# EAGLE schematic LTC6811_slave_24s_rev0 (EAGLE 9.3.1)

## Sheet 1 of 2
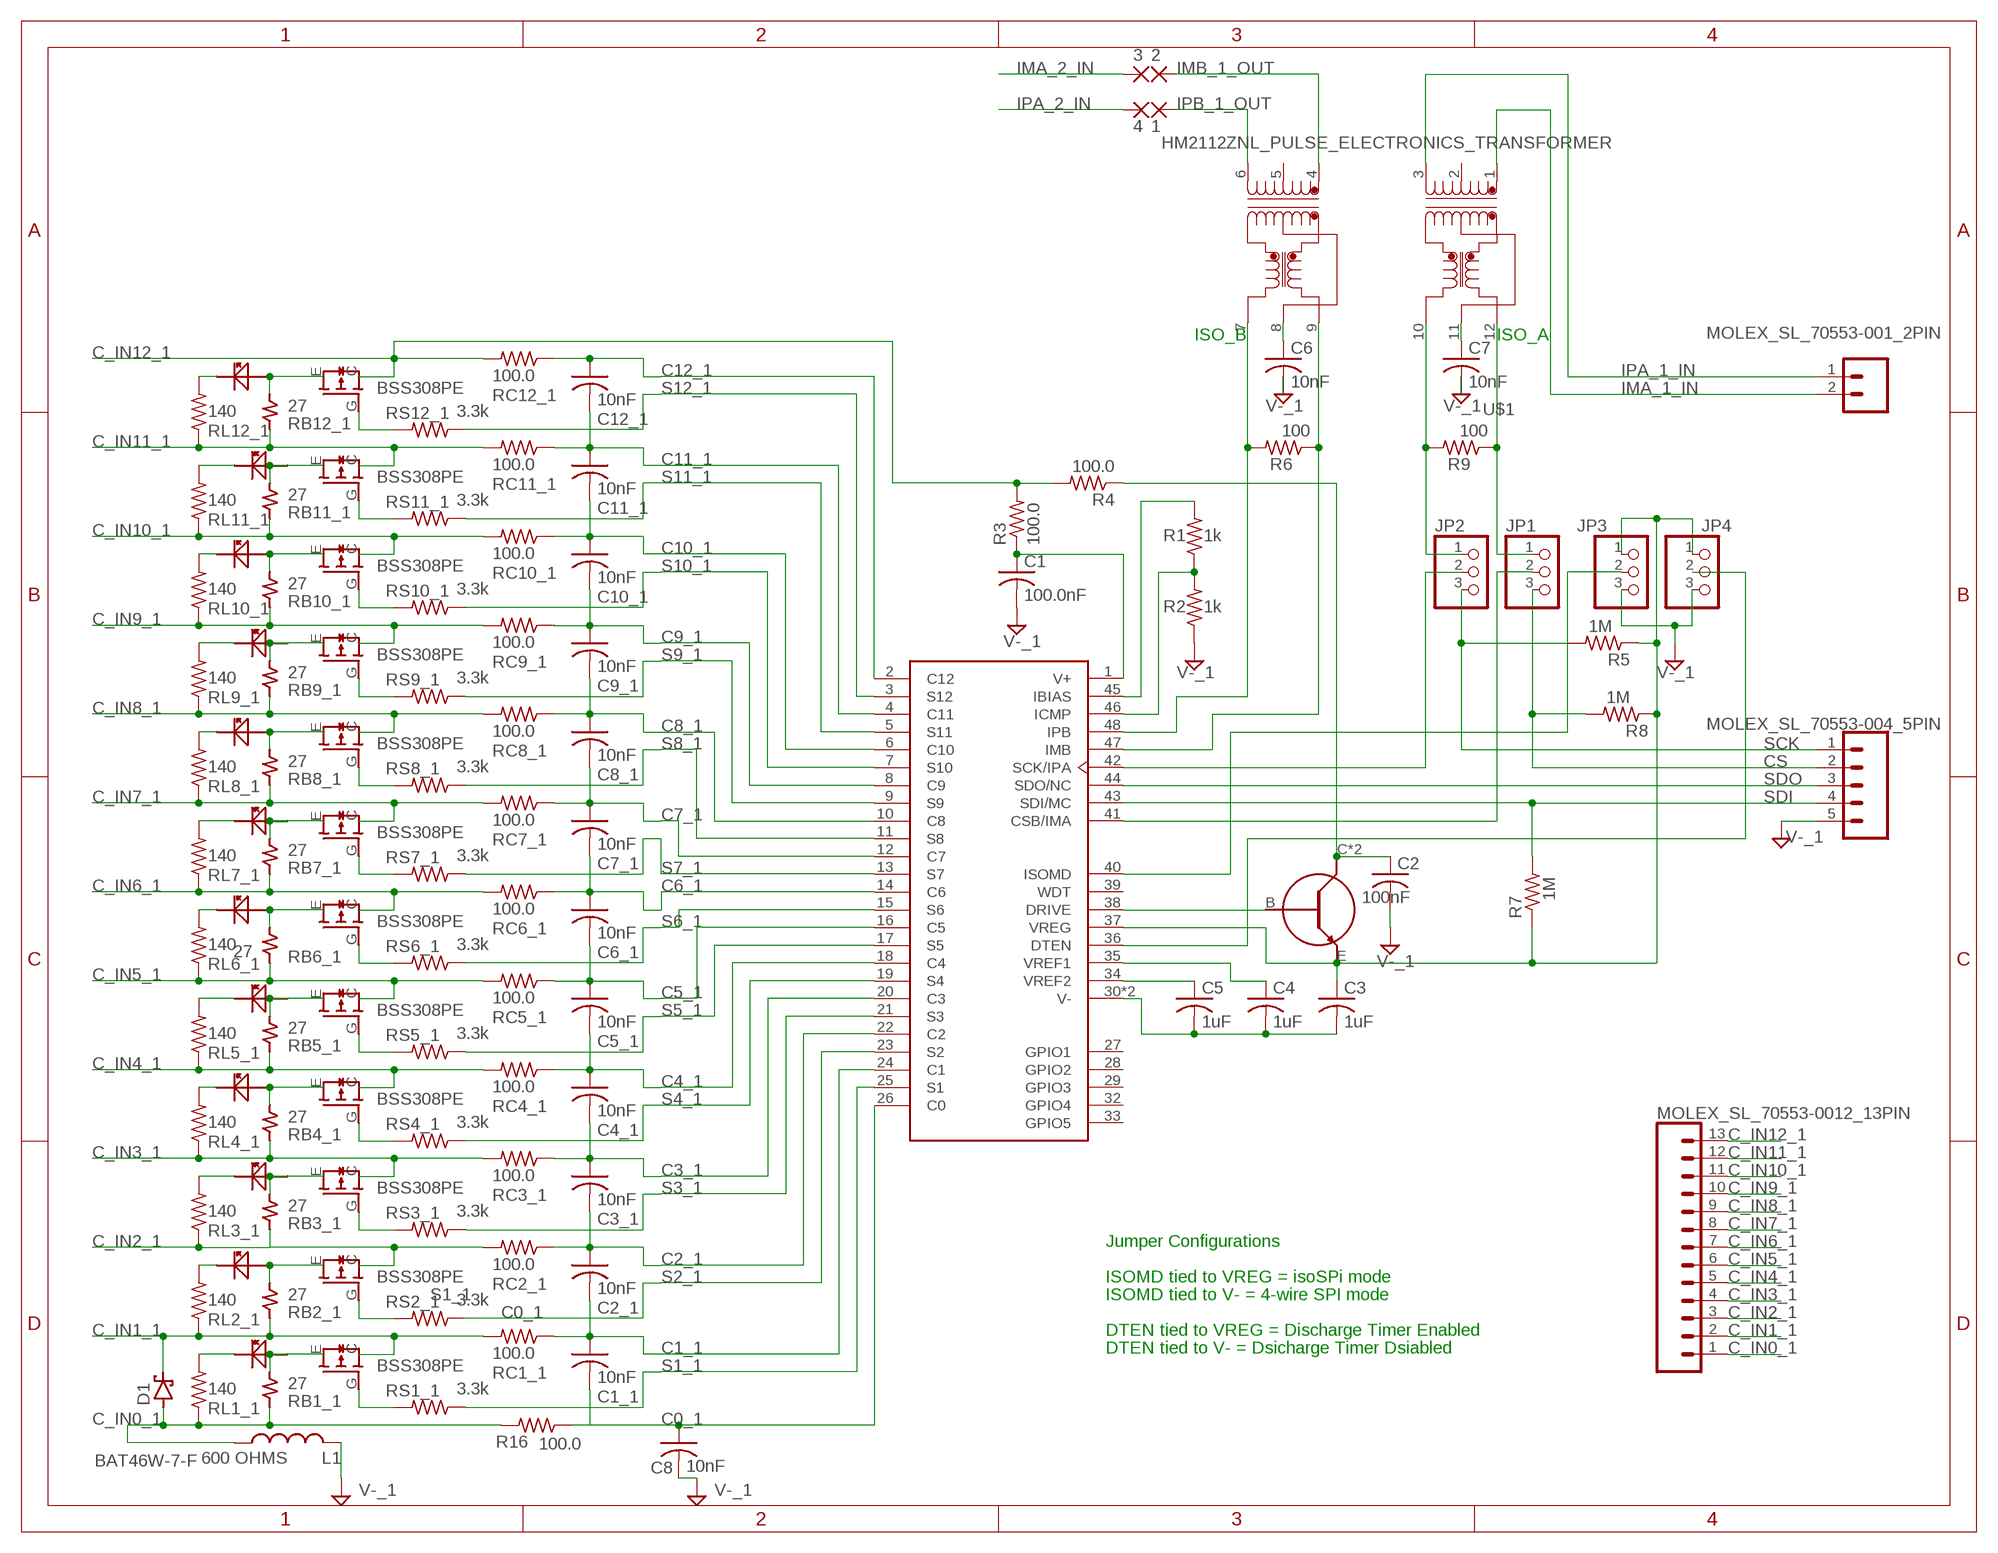
[diagram p0: schematic, sheet 1]

### Parts
1  WIREPAD2,15/1,0  [2,15/1,0]
2  WIREPAD2,15/1,0  [2,15/1,0]
3  WIREPAD2,15/1,0  [2,15/1,0]
4  WIREPAD2,15/1,0  [2,15/1,0]
C1  100.0nF  C-USC0805  [C0805]
C1_1  10nF  C-USC0805  [C0805]
C2  100nF  C-USC0805  [C0805]
C2_1  10nF  C-USC0805  [C0805]
C3  1uF  C-USC0805  [C0805]
C3_1  10nF  C-USC0805  [C0805]
C4  1uF  C-USC0805  [C0805]
C4_1  10nF  C-USC0805  [C0805]
C5  1uF  C-USC0805  [C0805]
C5_1  10nF  C-USC0805  [C0805]
C6  10nF  C-USC0805  [C0805]
C6_1  10nF  C-USC0805  [C0805]
C7  10nF  C-USC0805  [C0805]
C7_1  10nF  C-USC0805  [C0805]
C8  10nF  C-USC0805  [C0805]
C8_1  10nF  C-USC0805  [C0805]
C9_1  10nF  C-USC0805  [C0805]
C10_1  10nF  C-USC0805  [C0805]
C11_1  10nF  C-USC0805  [C0805]
C12_1  10nF  C-USC0805  [C0805]
D1  BAT46W-7-F  [SOD123]
DZT5551-13  DZT5551-13  [SOT223-4]
JP1  PINHD-1X3  [1X03]
JP2  PINHD-1X3  [1X03]
JP3  PINHD-1X3  [1X03]
JP4  PINHD-1X3  [1X03]
L1  600 OHMS  0805_FERRITEBEAD_INDUCTOR  [0805_COMPONENT]
LED1_3  LED_0805  [0805_COMPONENT]
LED1_4  LED_0805  [0805_COMPONENT]
LED1_5  LED_0805  [0805_COMPONENT]
LED1_6  LED_0805  [0805_COMPONENT]
LED1_7  LED_0805  [0805_COMPONENT]
LED1_8  LED_0805  [0805_COMPONENT]
LED1_9  LED_0805  [0805_COMPONENT]
LED1_10  LED_0805  [0805_COMPONENT]
LED1_11  LED_0805  [0805_COMPONENT]
LED1_12  LED_0805  [0805_COMPONENT]
LED1_13  LED_0805  [0805_COMPONENT]
LED1_14  LED_0805  [0805_COMPONENT]
MOLEX_SL_70553-001_2PIN  CONN_02  [1X02]
MOLEX_SL_70553-004_5PIN  CONN_05  [1X05]
MOLEX_SL_70553-0012_13PIN  CONN_13  [1X13]
R1  1k  R-US_R0805  [R0805]
R2  1k  R-US_R0805  [R0805]
R3  100.0  R-US_R0805  [R0805]
R4  100.0  R-US_R0805  [R0805]
R5  1M  R-US_R0805  [R0805]
R6  100  R-US_R0805  [R0805]
R7  1M  R-US_R0805  [R0805]
R8  1M  R-US_R0805  [R0805]
R9  100  R-US_R0805  [R0805]
R16  100.0  R-US_R0805  [R0805]
RB1_1  27  2817_RESISTOR  [2817_COMPONENT]
RB2_1  27  2817_RESISTOR  [2817_COMPONENT]
RB3_1  27  2817_RESISTOR  [2817_COMPONENT]
RB4_1  27  2817_RESISTOR  [2817_COMPONENT]
RB5_1  27  2817_RESISTOR  [2817_COMPONENT]
RB6_1  27  2817_RESISTOR  [2817_COMPONENT]
RB7_1  27  2817_RESISTOR  [2817_COMPONENT]
RB8_1  27  2817_RESISTOR  [2817_COMPONENT]
RB9_1  27  2817_RESISTOR  [2817_COMPONENT]
RB10_1  27  2817_RESISTOR  [2817_COMPONENT]
RB11_1  27  2817_RESISTOR  [2817_COMPONENT]
RB12_1  27  2817_RESISTOR  [2817_COMPONENT]
RC1_1  100.0  R-US_R0805  [R0805]
RC2_1  100.0  R-US_R0805  [R0805]
RC3_1  100.0  R-US_R0805  [R0805]
RC4_1  100.0  R-US_R0805  [R0805]
RC5_1  100.0  R-US_R0805  [R0805]
RC6_1  100.0  R-US_R0805  [R0805]
RC7_1  100.0  R-US_R0805  [R0805]
RC8_1  100.0  R-US_R0805  [R0805]
RC9_1  100.0  R-US_R0805  [R0805]
RC10_1  100.0  R-US_R0805  [R0805]
RC11_1  100.0  R-US_R0805  [R0805]
RC12_1  100.0  R-US_R0805  [R0805]
RL1_1  140  R-US_R0805  [R0805]
RL2_1  140  R-US_R0805  [R0805]
RL3_1  140  R-US_R0805  [R0805]
RL4_1  140  R-US_R0805  [R0805]
RL5_1  140  R-US_R0805  [R0805]
RL6_1  140  R-US_R0805  [R0805]
RL7_1  140  R-US_R0805  [R0805]
RL8_1  140  R-US_R0805  [R0805]
RL9_1  140  R-US_R0805  [R0805]
RL10_1  140  R-US_R0805  [R0805]
RL11_1  140  R-US_R0805  [R0805]
RL12_1  140  R-US_R0805  [R0805]
RS1_1  3.3k  R-US_R0805  [R0805]
RS2_1  3.3k  R-US_R0805  [R0805]
RS3_1  3.3k  R-US_R0805  [R0805]
RS4_1  3.3k  R-US_R0805  [R0805]
RS5_1  3.3k  R-US_R0805  [R0805]
RS6_1  3.3k  R-US_R0805  [R0805]
RS7_1  3.3k  R-US_R0805  [R0805]
RS8_1  3.3k  R-US_R0805  [R0805]
RS9_1  3.3k  R-US_R0805  [R0805]
RS10_1  3.3k  R-US_R0805  [R0805]
RS11_1  3.3k  R-US_R0805  [R0805]
RS12_1  3.3k  R-US_R0805  [R0805]
T1_3  BSS308PEH6327  [SOT23]
T1_4  BSS308PEH6327  [SOT23]
T1_5  BSS308PEH6327  [SOT23]
T1_6  BSS308PEH6327  [SOT23]
T1_7  BSS308PEH6327  [SOT23]
T1_8  BSS308PEH6327  [SOT23]
T1_9  BSS308PEH6327  [SOT23]
T1_10  BSS308PEH6327  [SOT23]
T1_11  BSS308PEH6327  [SOT23]
T1_12  BSS308PEH6327  [SOT23]
T1_13  BSS308PEH6327  [SOT23]
T1_14  BSS308PEH6327  [SOT23]
U1  LTC6811HG-2#PBF  [LTC6811-1]
U$1  HM2112ZNL_PULSE_ELECTRONICS_TRANSFORMER  [HM2112ZNL_12SMT]

### Nets
C0_1: C8.1 R16.1 U1.26(C0)
C1_1: C1_1.1 C2_1.2 RC1_1.1 U1.24(C1)
C2_1: C2_1.1 C3_1.2 RC2_1.1 U1.22(C2)
C3_1: C3_1.1 C4_1.2 RC3_1.1 U1.20(C3)
C4_1: C4_1.1 C5_1.2 RC4_1.1 U1.18(C4)
C5_1: C5_1.1 C6_1.2 RC5_1.1 U1.16(C5)
C6_1: C6_1.1 C7_1.2 RC6_1.1 U1.14(C6)
C7_1: C7_1.1 C8_1.2 RC7_1.1 U1.12(C7)
C8_1: C8_1.1 C9_1.2 RC8_1.1 U1.10(C8)
C9_1: C9_1.1 C10_1.2 RC9_1.1 U1.8(C9)
C10_1: C10_1.1 C11_1.2 RC10_1.1 U1.6(C10)
C11_1: C11_1.1 C12_1.2 RC11_1.1 U1.4(C11)
C12_1: C12_1.1 RC12_1.1 U1.2(C12)
C_IN0_1: D1.A L1.1 MOLEX_SL_70553-0012_13PIN.1 R16.2 RB1_1.2 RL1_1.1
C_IN1_1: D1.C MOLEX_SL_70553-0012_13PIN.2 RB2_1.2 RC1_1.2 RL2_1.1 T1_3.C
C_IN2_1: MOLEX_SL_70553-0012_13PIN.3 RB3_1.2 RC2_1.2 RL3_1.1 T1_4.C
C_IN3_1: MOLEX_SL_70553-0012_13PIN.4 RB4_1.2 RC3_1.2 RL4_1.1 T1_7.C
C_IN4_1: MOLEX_SL_70553-0012_13PIN.5 RB5_1.2 RC4_1.2 RL5_1.1 T1_8.C
C_IN5_1: MOLEX_SL_70553-0012_13PIN.6 RB6_1.2 RC5_1.2 RL6_1.1 T1_5.C
C_IN6_1: MOLEX_SL_70553-0012_13PIN.7 RB7_1.2 RC6_1.2 RL7_1.1 T1_6.C
C_IN7_1: MOLEX_SL_70553-0012_13PIN.8 RB8_1.2 RC7_1.2 RL8_1.1 T1_9.C
C_IN8_1: MOLEX_SL_70553-0012_13PIN.9 RB9_1.2 RC8_1.2 RL9_1.1 T1_10.C
C_IN9_1: MOLEX_SL_70553-0012_13PIN.10 RB10_1.2 RC9_1.2 RL10_1.1 T1_11.C
C_IN10_1: MOLEX_SL_70553-0012_13PIN.11 RB11_1.2 RC10_1.2 RL11_1.1 T1_12.C
C_IN11_1: MOLEX_SL_70553-0012_13PIN.12 RB12_1.2 RC11_1.2 RL12_1.1 T1_13.C
C_IN12_1: MOLEX_SL_70553-0012_13PIN.13 R3.2 R4.2 RC12_1.2 T1_14.C
CS: JP1.3 MOLEX_SL_70553-004_5PIN.2 R8.2
CS_OR_IMA: JP1.2 U1.41(CSB/IMA)
DRIVE: DZT5551-13.B U1.38(DRIVE)
DTEN: JP4.2 U1.36(DTEN)
IBIAS: R1.2 U1.45(IBIAS)
ICMP: R1.1 R2.2 U1.46(ICMP)
IMA_1_IN: MOLEX_SL_70553-001_2PIN.2 U$1.1
IMA_2_IN: 3.1(P) ; also sheet 2
IMB: R6.1 U1.47(IMB) U$1.9
IMB_1_OUT: 2.1(P) U$1.4
IPA_1_IN: MOLEX_SL_70553-001_2PIN.1 U$1.3
IPA_2_IN: 4.1(P) ; also sheet 2
IPB: R6.2 U1.48(IPB) U$1.7
IPB_1_OUT: 1.1(P) U$1.6
ISOMD: JP3.2 U1.40(ISOMD)
N$3: C6.1 U$1.8
N$5: C1.1 R3.1 U1.1(V+)
N$7: JP2.1 R9.2 U$1.10
N$8: JP1.1 R9.1 U$1.12
N$9: C7.1 U$1.11
N$32: LED1_11.2 RB9_1.1 T1_11.E
N$33: RS9_1.2 T1_11.G(B)
N$34: LED1_11.1 RL9_1.2
N$35: LED1_12.2 RB10_1.1 T1_12.E
N$36: RS10_1.2 T1_12.G(B)
N$37: LED1_12.1 RL10_1.2
N$39: LED1_13.2 RB11_1.1 T1_13.E
N$40: LED1_3.2 RB1_1.1 T1_3.E
N$41: RS1_1.2 T1_3.G(B)
N$42: LED1_3.1 RL1_1.2
N$43: LED1_4.2 RB2_1.1 T1_4.E
N$44: RS2_1.2 T1_4.G(B)
N$45: LED1_4.1 RL2_1.2
N$46: C1_1.2
N$48: LED1_5.2 RB5_1.1 T1_5.E
N$49: RS5_1.2 T1_5.G(B)
N$50: LED1_5.1 RL5_1.2
N$51: LED1_6.2 RB6_1.1 T1_6.E
N$52: RS6_1.2 T1_6.G(B)
N$53: LED1_6.1 RL6_1.2
N$55: LED1_9.2 RB7_1.1 T1_9.E
N$56: LED1_7.2 RB3_1.1 T1_7.E
N$57: RS3_1.2 T1_7.G(B)
N$58: LED1_7.1 RL3_1.2
N$59: LED1_8.2 RB4_1.1 T1_8.E
N$60: RS4_1.2 T1_8.G(B)
N$61: LED1_8.1 RL4_1.2
N$62: RS11_1.2 T1_13.G(B)
N$63: RS7_1.2 T1_9.G(B)
N$64: LED1_9.1 RL7_1.2
N$65: LED1_10.2 RB8_1.1 T1_10.E
N$66: RS8_1.2 T1_10.G(B)
N$67: LED1_10.1 RL8_1.2
N$69: LED1_13.1 RL11_1.2
N$70: LED1_14.2 RB12_1.1 T1_14.E
N$71: RS12_1.2 T1_14.G(B)
N$72: LED1_14.1 RL12_1.2
S1_1: RS1_1.1 U1.25(S1)
S2_1: RS2_1.1 U1.23(S2)
S3_1: RS3_1.1 U1.21(S3)
S4_1: RS4_1.1 U1.19(S4)
S5_1: RS5_1.1 U1.17(S5)
S6_1: RS6_1.1 U1.15(S6)
S7_1: RS7_1.1 U1.13(S7)
S8_1: RS8_1.1 U1.11(S8)
S9_1: RS9_1.1 U1.9(S9)
S10_1: RS10_1.1 U1.7(S10)
S11_1: RS11_1.1 U1.5(S11)
S12_1: RS12_1.1 U1.3(S12)
SCK: JP2.3 MOLEX_SL_70553-004_5PIN.1 R5.2
SCK_OR_IPA: JP2.2 U1.42(SCK/IPA)
SDI: MOLEX_SL_70553-004_5PIN.4 R7.2 U1.43(SDI/MC)
SDO: MOLEX_SL_70553-004_5PIN.3 U1.44(SDO/NC)
V-_1: C1.2 C2.2 C3.2 C4.2 C5.2 C6.2 C7.2 C8.2 JP3.3 JP4.3 L1.2 MOLEX_SL_70553-004_5PIN.5 R2.1 U1.30(V-) U1.31(V-) ; supply symbol labelled GND
VREF1_C4: C4.1 U1.35(VREF1)
VREF2_C5: C5.1 U1.34(VREF2)
VREG: C3.1 DZT5551-13.E JP3.1 JP4.1 R5.1 R7.1 R8.1 U1.37(VREG)
VREG_CAP: C2.1 DZT5551-13.C DZT5551-13.C@2(C) R4.1
Unconnected: U1.27(GPIO1) U1.28(GPIO2) U1.29(GPIO3) U1.32(GPIO4) U1.33(GPIO5) U1.39(WDT) U$1.2 U$1.5

### Notes on the sheet
- ISO_B | ISO_A
- Jumper Configurations
- ISOMD tied to VREG = isoSPi mode
- ISOMD tied to V- = 4-wire SPI mode
- DTEN tied to VREG = Discharge Timer Enabled
- DTEN tied to V- = Dsicharge Timer Dsiabled

## Sheet 2 of 2
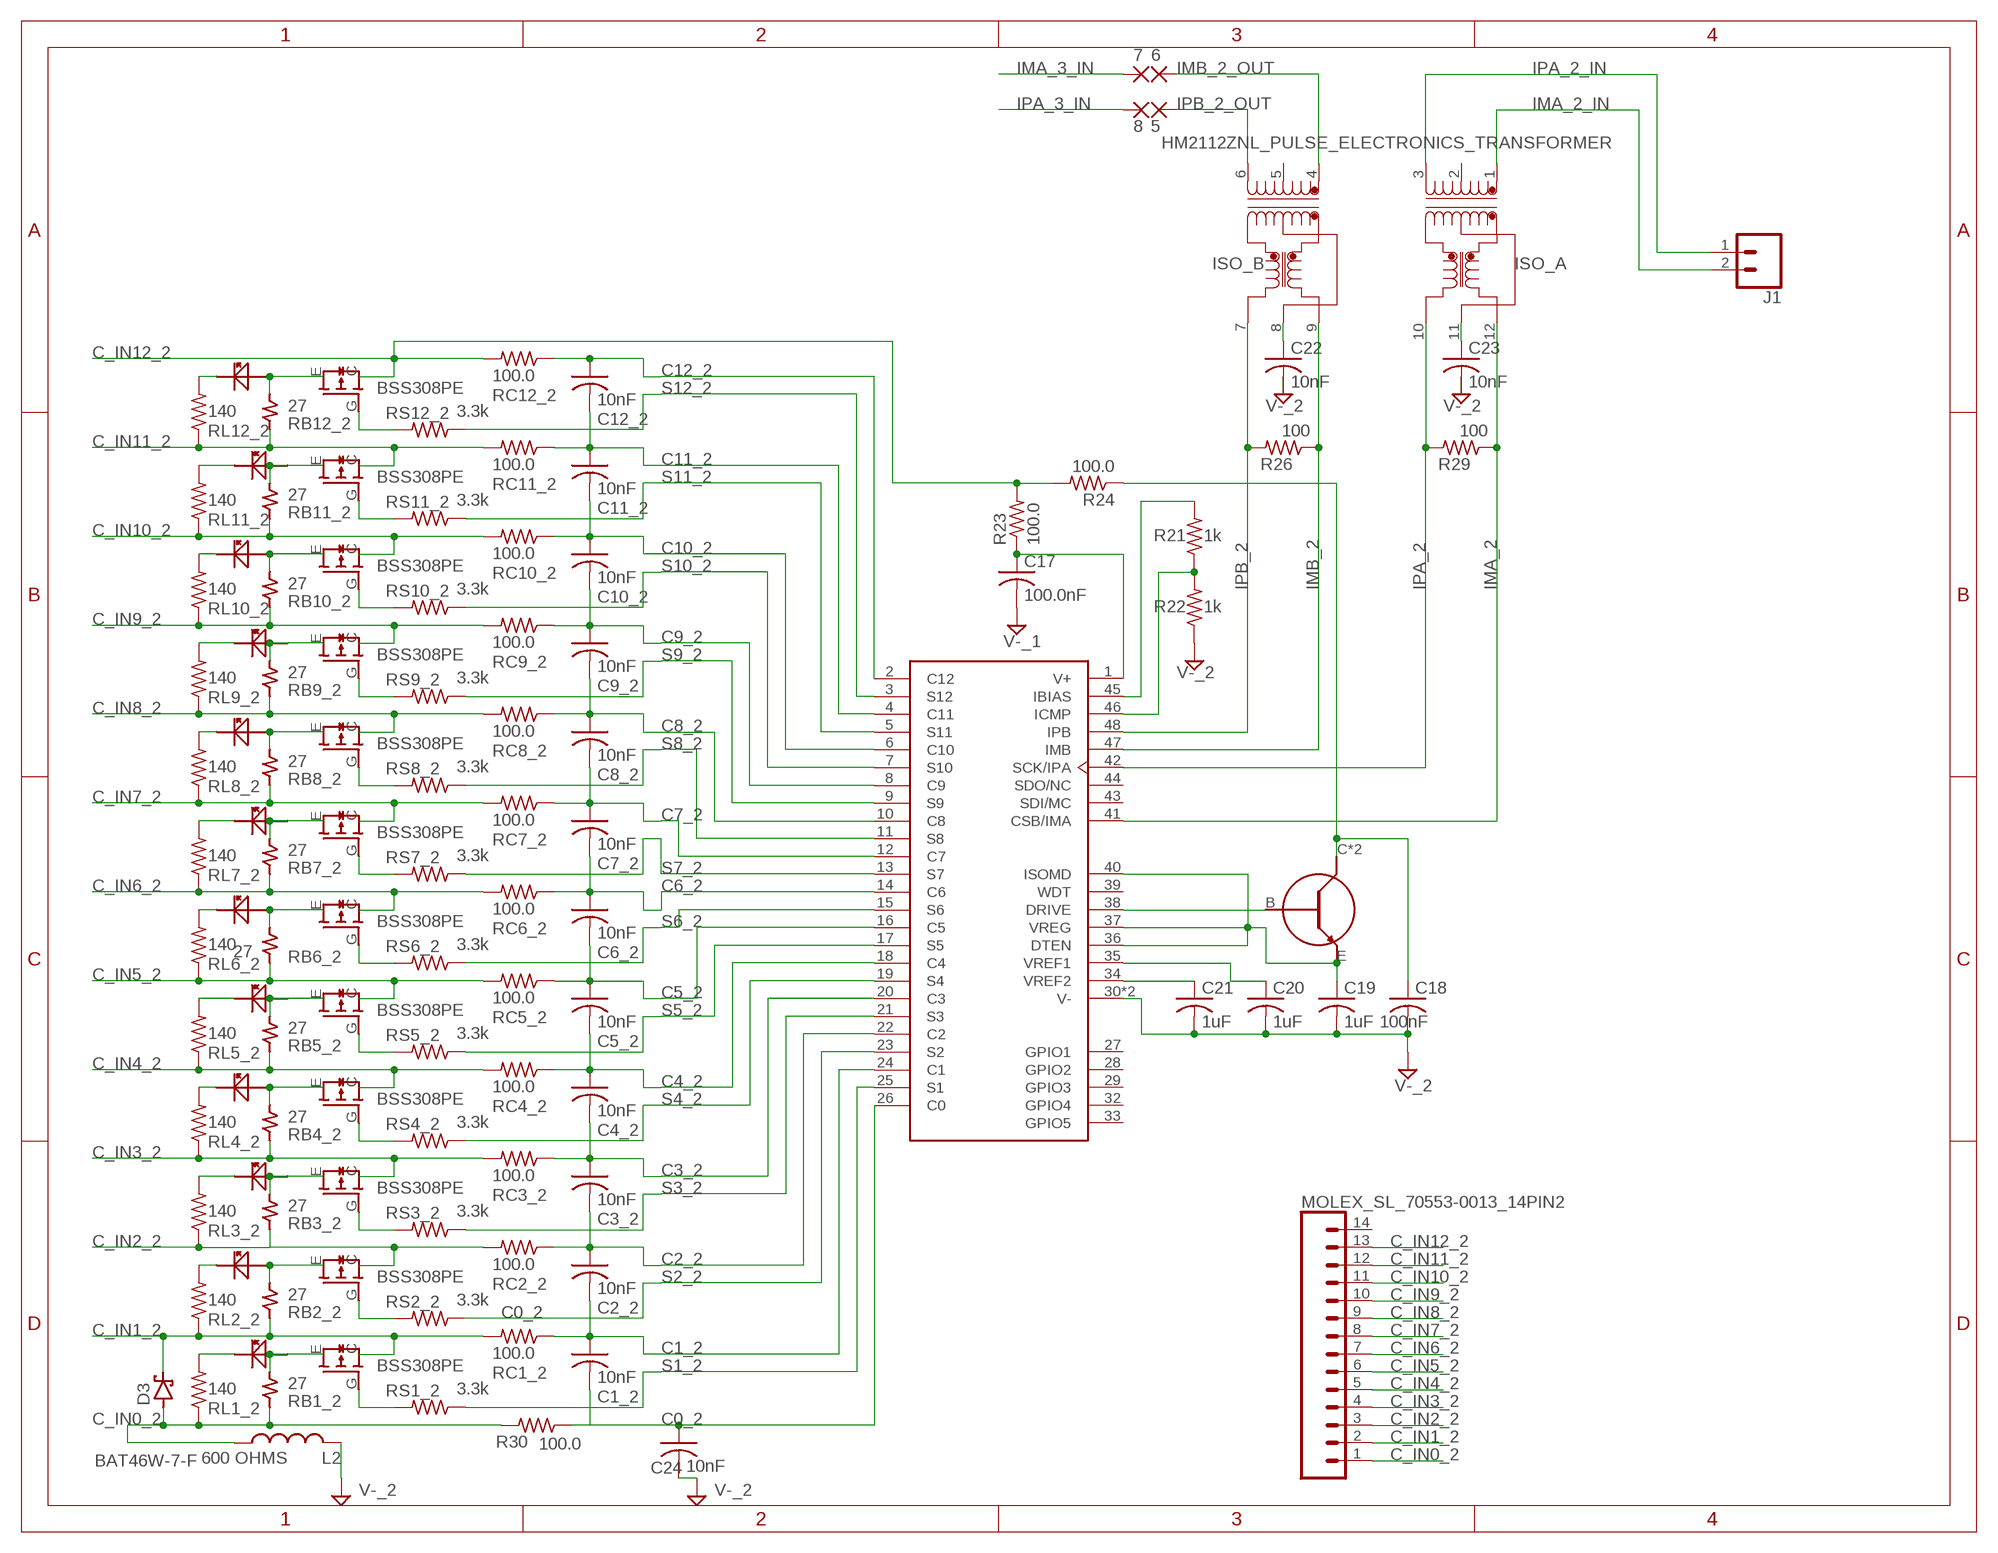
[diagram p1: schematic, sheet 2]

### Parts
5  WIREPAD2,15/1,0  [2,15/1,0]
6  WIREPAD2,15/1,0  [2,15/1,0]
7  WIREPAD2,15/1,0  [2,15/1,0]
8  WIREPAD2,15/1,0  [2,15/1,0]
C1_2  10nF  C-USC0805  [C0805]
C2_2  10nF  C-USC0805  [C0805]
C3_2  10nF  C-USC0805  [C0805]
C4_2  10nF  C-USC0805  [C0805]
C5_2  10nF  C-USC0805  [C0805]
C6_2  10nF  C-USC0805  [C0805]
C7_2  10nF  C-USC0805  [C0805]
C8_2  10nF  C-USC0805  [C0805]
C9_2  10nF  C-USC0805  [C0805]
C10_2  10nF  C-USC0805  [C0805]
C11_2  10nF  C-USC0805  [C0805]
C12_2  10nF  C-USC0805  [C0805]
C17  100.0nF  C-USC0805  [C0805]
C18  100nF  C-USC0805  [C0805]
C19  1uF  C-USC0805  [C0805]
C20  1uF  C-USC0805  [C0805]
C21  1uF  C-USC0805  [C0805]
C22  10nF  C-USC0805  [C0805]
C23  10nF  C-USC0805  [C0805]
C24  10nF  C-USC0805  [C0805]
D3  BAT46W-7-F  [SOD123]
DZT5551-2  DZT5551-13  [SOT223-4]
J1  CONN_02  [1X02]
L2  600 OHMS  0805_FERRITEBEAD_INDUCTOR  [0805_COMPONENT]
LED1_25  LED_0805  [0805_COMPONENT]
LED1_26  LED_0805  [0805_COMPONENT]
LED1_27  LED_0805  [0805_COMPONENT]
LED1_28  LED_0805  [0805_COMPONENT]
LED1_29  LED_0805  [0805_COMPONENT]
LED1_30  LED_0805  [0805_COMPONENT]
LED1_31  LED_0805  [0805_COMPONENT]
LED1_32  LED_0805  [0805_COMPONENT]
LED1_33  LED_0805  [0805_COMPONENT]
LED1_34  LED_0805  [0805_COMPONENT]
LED1_35  LED_0805  [0805_COMPONENT]
LED1_36  LED_0805  [0805_COMPONENT]
MOLEX_SL_70553-0013_14PIN2  CONN_14  [1X14]
R21  1k  R-US_R0805  [R0805]
R22  1k  R-US_R0805  [R0805]
R23  100.0  R-US_R0805  [R0805]
R24  100.0  R-US_R0805  [R0805]
R26  100  R-US_R0805  [R0805]
R29  100  R-US_R0805  [R0805]
R30  100.0  R-US_R0805  [R0805]
RB1_2  27  2817_RESISTOR  [2817_COMPONENT]
RB2_2  27  2817_RESISTOR  [2817_COMPONENT]
RB3_2  27  2817_RESISTOR  [2817_COMPONENT]
RB4_2  27  2817_RESISTOR  [2817_COMPONENT]
RB5_2  27  2817_RESISTOR  [2817_COMPONENT]
RB6_2  27  2817_RESISTOR  [2817_COMPONENT]
RB7_2  27  2817_RESISTOR  [2817_COMPONENT]
RB8_2  27  2817_RESISTOR  [2817_COMPONENT]
RB9_2  27  2817_RESISTOR  [2817_COMPONENT]
RB10_2  27  2817_RESISTOR  [2817_COMPONENT]
RB11_2  27  2817_RESISTOR  [2817_COMPONENT]
RB12_2  27  2817_RESISTOR  [2817_COMPONENT]
RC1_2  100.0  R-US_R0805  [R0805]
RC2_2  100.0  R-US_R0805  [R0805]
RC3_2  100.0  R-US_R0805  [R0805]
RC4_2  100.0  R-US_R0805  [R0805]
RC5_2  100.0  R-US_R0805  [R0805]
RC6_2  100.0  R-US_R0805  [R0805]
RC7_2  100.0  R-US_R0805  [R0805]
RC8_2  100.0  R-US_R0805  [R0805]
RC9_2  100.0  R-US_R0805  [R0805]
RC10_2  100.0  R-US_R0805  [R0805]
RC11_2  100.0  R-US_R0805  [R0805]
RC12_2  100.0  R-US_R0805  [R0805]
RL1_2  140  R-US_R0805  [R0805]
RL2_2  140  R-US_R0805  [R0805]
RL3_2  140  R-US_R0805  [R0805]
RL4_2  140  R-US_R0805  [R0805]
RL5_2  140  R-US_R0805  [R0805]
RL6_2  140  R-US_R0805  [R0805]
RL7_2  140  R-US_R0805  [R0805]
RL8_2  140  R-US_R0805  [R0805]
RL9_2  140  R-US_R0805  [R0805]
RL10_2  140  R-US_R0805  [R0805]
RL11_2  140  R-US_R0805  [R0805]
RL12_2  140  R-US_R0805  [R0805]
RS1_2  3.3k  R-US_R0805  [R0805]
RS2_2  3.3k  R-US_R0805  [R0805]
RS3_2  3.3k  R-US_R0805  [R0805]
RS4_2  3.3k  R-US_R0805  [R0805]
RS5_2  3.3k  R-US_R0805  [R0805]
RS6_2  3.3k  R-US_R0805  [R0805]
RS7_2  3.3k  R-US_R0805  [R0805]
RS8_2  3.3k  R-US_R0805  [R0805]
RS9_2  3.3k  R-US_R0805  [R0805]
RS10_2  3.3k  R-US_R0805  [R0805]
RS11_2  3.3k  R-US_R0805  [R0805]
RS12_2  3.3k  R-US_R0805  [R0805]
T1_25  BSS308PEH6327  [SOT23]
T1_26  BSS308PEH6327  [SOT23]
T1_27  BSS308PEH6327  [SOT23]
T1_28  BSS308PEH6327  [SOT23]
T1_29  BSS308PEH6327  [SOT23]
T1_30  BSS308PEH6327  [SOT23]
T1_31  BSS308PEH6327  [SOT23]
T1_32  BSS308PEH6327  [SOT23]
T1_33  BSS308PEH6327  [SOT23]
T1_34  BSS308PEH6327  [SOT23]
T1_35  BSS308PEH6327  [SOT23]
T1_36  BSS308PEH6327  [SOT23]
U3  LTC6811HG-2#PBF  [LTC6811-1]
U$3  HM2112ZNL_PULSE_ELECTRONICS_TRANSFORMER  [HM2112ZNL_12SMT]

### Nets
C0_2: C24.1 R30.1 U3.26(C0)
C1_2: C1_2.1 C2_2.2 RC1_2.1 U3.24(C1)
C2_2: C2_2.1 C3_2.2 RC2_2.1 U3.22(C2)
C3_2: C3_2.1 C4_2.2 RC3_2.1 U3.20(C3)
C4_2: C4_2.1 C5_2.2 RC4_2.1 U3.18(C4)
C5_2: C5_2.1 C6_2.2 RC5_2.1 U3.16(C5)
C6_2: C6_2.1 C7_2.2 RC6_2.1 U3.14(C6)
C7_2: C7_2.1 C8_2.2 RC7_2.1 U3.12(C7)
C8_2: C8_2.1 C9_2.2 RC8_2.1 U3.10(C8)
C9_2: C9_2.1 C10_2.2 RC9_2.1 U3.8(C9)
C10_2: C10_2.1 C11_2.2 RC10_2.1 U3.6(C10)
C11_2: C11_2.1 C12_2.2 RC11_2.1 U3.4(C11)
C12_2: C12_2.1 RC12_2.1 U3.2(C12)
C_IN0_2: D3.A L2.1 MOLEX_SL_70553-0013_14PIN2.1 R30.2 RB1_2.2 RL1_2.1
C_IN1_2: D3.C MOLEX_SL_70553-0013_14PIN2.2 RB2_2.2 RC1_2.2 RL2_2.1 T1_25.C
C_IN2_2: MOLEX_SL_70553-0013_14PIN2.3 RB3_2.2 RC2_2.2 RL3_2.1 T1_26.C
C_IN3_2: MOLEX_SL_70553-0013_14PIN2.4 RB4_2.2 RC3_2.2 RL4_2.1 T1_27.C
C_IN4_2: MOLEX_SL_70553-0013_14PIN2.5 RB5_2.2 RC4_2.2 RL5_2.1 T1_28.C
C_IN5_2: MOLEX_SL_70553-0013_14PIN2.6 RB6_2.2 RC5_2.2 RL6_2.1 T1_29.C
C_IN6_2: MOLEX_SL_70553-0013_14PIN2.7 RB7_2.2 RC6_2.2 RL7_2.1 T1_30.C
C_IN7_2: MOLEX_SL_70553-0013_14PIN2.8 RB8_2.2 RC7_2.2 RL8_2.1 T1_31.C
C_IN8_2: MOLEX_SL_70553-0013_14PIN2.9 RB9_2.2 RC8_2.2 RL9_2.1 T1_32.C
C_IN9_2: MOLEX_SL_70553-0013_14PIN2.10 RB10_2.2 RC9_2.2 RL10_2.1 T1_33.C
C_IN10_2: MOLEX_SL_70553-0013_14PIN2.11 RB11_2.2 RC10_2.2 RL11_2.1 T1_34.C
C_IN11_2: MOLEX_SL_70553-0013_14PIN2.12 RB12_2.2 RC11_2.2 RL12_2.1 T1_35.C
C_IN12_2: MOLEX_SL_70553-0013_14PIN2.13 R23.2 R24.2 RC12_2.2 T1_36.C
DRIVE_2: DZT5551-2.B U3.38(DRIVE)
IBIAS_2: R21.2 U3.45(IBIAS)
ICMP_2: R21.1 R22.2 U3.46(ICMP)
IMA_2: R29.1 U3.41(CSB/IMA) U$3.12
IMA_2_IN: J1.2 U$3.1 ; also sheet 1
IMA_3_IN: 7.1(P)
IMB_2: R26.1 U3.47(IMB) U$3.9
IMB_2_OUT: 6.1(P) U$3.4
IPA_2: R29.2 U3.42(SCK/IPA) U$3.10
IPA_2_IN: J1.1 U$3.3 ; also sheet 1
IPA_3_IN: 8.1(P)
IPB_2: R26.2 U3.48(IPB) U$3.7
IPB_2_OUT: 5.1(P) U$3.6
N$85: C17.1 R23.1 U3.1(V+)
N$86: C22.1 U$3.8
N$89: C23.1 U$3.11
N$90: LED1_25.2 RB1_2.1 T1_25.E
N$91: RS1_2.2 T1_25.G(B)
N$92: LED1_25.1 RL1_2.2
N$93: LED1_26.2 RB2_2.1 T1_26.E
N$94: RS2_2.2 T1_26.G(B)
N$95: LED1_26.1 RL2_2.2
N$96: C1_2.2
N$97: LED1_27.2 RB3_2.1 T1_27.E
N$98: RS3_2.2 T1_27.G(B)
N$99: LED1_27.1 RL3_2.2
N$100: LED1_28.2 RB4_2.1 T1_28.E
N$101: RS4_2.2 T1_28.G(B)
N$102: LED1_28.1 RL4_2.2
N$103: LED1_29.2 RB5_2.1 T1_29.E
N$104: RS5_2.2 T1_29.G(B)
N$105: LED1_29.1 RL5_2.2
N$106: LED1_30.2 RB6_2.1 T1_30.E
N$107: RS6_2.2 T1_30.G(B)
N$108: LED1_30.1 RL6_2.2
N$109: LED1_31.2 RB7_2.1 T1_31.E
N$110: RS7_2.2 T1_31.G(B)
N$111: LED1_31.1 RL7_2.2
N$112: LED1_32.2 RB8_2.1 T1_32.E
N$113: RS8_2.2 T1_32.G(B)
N$114: LED1_32.1 RL8_2.2
N$115: LED1_33.2 RB9_2.1 T1_33.E
N$116: RS9_2.2 T1_33.G(B)
N$117: LED1_33.1 RL9_2.2
N$118: LED1_34.2 RB10_2.1 T1_34.E
N$119: RS10_2.2 T1_34.G(B)
N$120: LED1_34.1 RL10_2.2
N$121: LED1_35.2 RB11_2.1 T1_35.E
N$122: RS11_2.2 T1_35.G(B)
N$123: LED1_35.1 RL11_2.2
N$124: LED1_36.2 RB12_2.1 T1_36.E
N$125: RS12_2.2 T1_36.G(B)
N$126: LED1_36.1 RL12_2.2
S1_2: RS1_2.1 U3.25(S1)
S2_2: RS2_2.1 U3.23(S2)
S3_2: RS3_2.1 U3.21(S3)
S4_2: RS4_2.1 U3.19(S4)
S5_2: RS5_2.1 U3.17(S5)
S6_2: RS6_2.1 U3.15(S6)
S7_2: RS7_2.1 U3.13(S7)
S8_2: RS8_2.1 U3.11(S8)
S9_2: RS9_2.1 U3.9(S9)
S10_2: RS10_2.1 U3.7(S10)
S11_2: RS11_2.1 U3.5(S11)
S12_2: RS12_2.1 U3.3(S12)
V-_2: C17.2 C18.2 C19.2 C20.2 C21.2 C22.2 C23.2 C24.2 L2.2 R22.1 U3.30(V-) U3.31(V-) ; supply symbol labelled V-_1, GND
VREF1_C4_2: C20.1 U3.35(VREF1)
VREF2_C5_2: C21.1 U3.34(VREF2)
VREG_2: C19.1 DZT5551-2.E U3.36(DTEN) U3.37(VREG) U3.40(ISOMD)
VREG_CAP_2: C18.1 DZT5551-2.C DZT5551-2.C@2(C) R24.1
Unconnected: MOLEX_SL_70553-0013_14PIN2.14 U3.27(GPIO1) U3.28(GPIO2) U3.29(GPIO3) U3.32(GPIO4) U3.33(GPIO5) U3.39(WDT) U3.43(SDI/MC) U3.44(SDO/NC) U$3.2 U$3.5

### Notes on the sheet
- ISO_B | ISO_A

## Library data of the parts
1-8 = wirepad:WIREPAD: Wire PAD connect wire on PCB
C1 C1_1 C1_2 C2 C2_1 C2_2 C3 C3_1 C3_2 C4 C4_1 C4_2 C5 C5_1 C5_2 C6 C6_1 C6_2 C7 C7_1 C7_2 C8 C8_1 C8_2 C9_1 C9_2 C10_1 C10_2 C11_1 C11_2 C12_1 C12_2 C17-C24 = resistor:C-US: CAPACITOR, American symbol
D1 D3 = Library_Capstone:BAT46W-7-F
DZT5551-2 DZT5551-13 = Library_Capstone:DZT5551-13
J1 MOLEX_SL_70553-001_2PIN = SparkFun-Connectors:CONN_02: Multi connection point. Often used as Generic Header-pin footprint for 0.1 inch spaced/style header connections On any of the 0.1 inch spaced packages, you can populate with these: Break Away Headers - Straight <https://www.sparkfun.com/products/116> (PRT-00116) Break Away Male Headers - Right Angle <https://www.sparkfun.com/products/553> (PRT-00553) Female Headers <https://www.sparkfun.com/products/115> (PRT-00115) Break Away Headers - Machine Pin <https://www.sparkfun.com/products/117> (PRT-00117) Break Away Female Headers - Swiss Machine Pin <https://www.sparkfun.com/products/743> (PRT-00743) For SCREWTERMINALS and SPRING TERMINALS visit here: Screw Terimnals on SparkFun.com <https://www.sparkfun.com/search/results?term=Screw+Terminals> (5mm/3.5mm/2.54mm spacing) This device is also useful as a general connection point to wire up your design to another part of your project. Our various solder wires solder well into these plated through hole pads. Hook-Up Wire - Assortment (Stranded, 22 AWG) <https://www.sparkfun.com/products/11375> (PRT-11375) Hook-Up Wire - Assortment (Solid Core, 22 AWG) <https://www.sparkfun.com/products/11367> (PRT-11367) View the entire wire category on our website here <https://www.sparkfun.com/categories/141> Special notes: Molex polarized connector foot print use with: PRT-08233 with associated crimp pins and housings. 2.54_SCREWTERM for use with PRT-10571. 3.5mm Screw Terminal footprints for PRT-08084 5mm Screw Terminal footprints for use with PRT-08432
JP1-JP4 = pinhead:PINHD-1X3: PIN HEADER
L1 L2 = Library_Capstone:0805_FERRITEBEAD_INDUCTOR
LED1_3-LED1_14 LED1_25-LED1_36 = Library_Capstone:LED_0805
MOLEX_SL_70553-004_5PIN = SparkFun-Connectors:CONN_05: Multi connection point. Often used as Generic Header-pin footprint for 0.1 inch spaced/style header connections On any of the 0.1 inch spaced packages, you can populate with these: Break Away Headers - Straight <https://www.sparkfun.com/products/116> (PRT-00116) Break Away Male Headers - Right Angle <https://www.sparkfun.com/products/553> (PRT-00553) Female Headers <https://www.sparkfun.com/products/115> (PRT-00115) Break Away Headers - Machine Pin <https://www.sparkfun.com/products/117> (PRT-00117) Break Away Female Headers - Swiss Machine Pin <https://www.sparkfun.com/products/743> (PRT-00743) For SCREWTERMINALS and SPRING TERMINALS visit here: Screw Terimnals on SparkFun.com <https://www.sparkfun.com/search/results?term=Screw+Terminals> (5mm/3.5mm/2.54mm spacing) This device is also useful as a general connection point to wire up your design to another part of your project. Our various solder wires solder well into these plated through hole pads. Hook-Up Wire - Assortment (Stranded, 22 AWG) <https://www.sparkfun.com/products/11375> (PRT-11375) Hook-Up Wire - Assortment (Solid Core, 22 AWG) <https://www.sparkfun.com/products/11367> (PRT-11367) View the entire wire category on our website here <https://www.sparkfun.com/categories/141> Special notes: Molex polarized connector foot print use with SKU : PRT-08231 with associated crimp pins and housings. 1MM SMD Version SKU: PRT-10208
MOLEX_SL_70553-0012_13PIN = SparkFun-Connectors:CONN_13: Multi connection point. Often used as Generic Header-pin footprint for 0.1 inch spaced/style header connections On any of the 0.1 inch spaced packages, you can populate with these: Break Away Headers - Straight <https://www.sparkfun.com/products/116> (PRT-00116) Break Away Male Headers - Right Angle <https://www.sparkfun.com/products/553> (PRT-00553) Female Headers <https://www.sparkfun.com/products/115> (PRT-00115) Break Away Headers - Machine Pin <https://www.sparkfun.com/products/117> (PRT-00117) Break Away Female Headers - Swiss Machine Pin <https://www.sparkfun.com/products/743> (PRT-00743) For SCREWTERMINALS and SPRING TERMINALS visit here: Screw Terimnals on SparkFun.com <https://www.sparkfun.com/search/results?term=Screw+Terminals> (5mm/3.5mm/2.54mm spacing) This device is also useful as a general connection point to wire up your design to another part of your project. Our various solder wires solder well into these plated through hole pads. Hook-Up Wire - Assortment (Stranded, 22 AWG) <https://www.sparkfun.com/products/11375> (PRT-11375) Hook-Up Wire - Assortment (Solid Core, 22 AWG) <https://www.sparkfun.com/products/11367> (PRT-11367) View the entire wire category on our website here <https://www.sparkfun.com/categories/141> Special notes: Molex polarized connector foot print use with SKU : PRT-08231 with associated crimp pins and housings. 1MM SMD Version SKU: PRT-10208 NOTES ON THE VARIANTS LOCK and LOCK_LONGPADS... This footprint was designed to help hold the alignment of a through-hole component (i.e. 6-pin header) while soldering it into place. You may notice that each hole has been shifted either up or down by 0.005 of an inch from it's more standard position (which is a perfectly straight line). This slight alteration caused the pins (the squares in the middle) to touch the edges of the holes. Because they are alternating, it causes a "brace" to hold the component in place. 0.005 has proven to be the perfect amount of "off-center" position when using our standard breakaway headers. Although looks a little odd when you look at the bare footprint, once you have a header in there, the alteration is very hard to notice. Also,if you push a header all the way into place, it is covered up entirely on the bottom side.
MOLEX_SL_70553-0013_14PIN2 = SparkFun-Connectors:CONN_14: Multi connection point. Often used as Generic Header-pin footprint for 0.1 inch spaced/style header connections On any of the 0.1 inch spaced packages, you can populate with these: Break Away Headers - Straight <https://www.sparkfun.com/products/116> (PRT-00116) Break Away Male Headers - Right Angle <https://www.sparkfun.com/products/553> (PRT-00553) Female Headers <https://www.sparkfun.com/products/115> (PRT-00115) Break Away Headers - Machine Pin <https://www.sparkfun.com/products/117> (PRT-00117) Break Away Female Headers - Swiss Machine Pin <https://www.sparkfun.com/products/743> (PRT-00743) For SCREWTERMINALS and SPRING TERMINALS visit here: Screw Terimnals on SparkFun.com <https://www.sparkfun.com/search/results?term=Screw+Terminals> (5mm/3.5mm/2.54mm spacing) This device is also useful as a general connection point to wire up your design to another part of your project. Our various solder wires solder well into these plated through hole pads. Hook-Up Wire - Assortment (Stranded, 22 AWG) <https://www.sparkfun.com/products/11375> (PRT-11375) Hook-Up Wire - Assortment (Solid Core, 22 AWG) <https://www.sparkfun.com/products/11367> (PRT-11367) View the entire wire category on our website here <https://www.sparkfun.com/categories/141> Special notes: Molex polarized connector foot print use with SKU : PRT-08231 with associated crimp pins and housings. 1MM SMD Version SKU: PRT-10208 NOTES ON THE VARIANTS LOCK and LOCK_LONGPADS... This footprint was designed to help hold the alignment of a through-hole component (i.e. 6-pin header) while soldering it into place. You may notice that each hole has been shifted either up or down by 0.005 of an inch from it's more standard position (which is a perfectly straight line). This slight alteration caused the pins (the squares in the middle) to touch the edges of the holes. Because they are alternating, it causes a "brace" to hold the component in place. 0.005 has proven to be the perfect amount of "off-center" position when using our standard breakaway headers. Although looks a little odd when you look at the bare footprint, once you have a header in there, the alteration is very hard to notice. Also,if you push a header all the way into place, it is covered up entirely on the bottom side.
R1-R9 R16 R21-R24 R26 R29 R30 RC1_1 RC1_2 RC2_1 RC2_2 RC3_1 RC3_2 RC4_1 RC4_2 RC5_1 RC5_2 RC6_1 RC6_2 RC7_1 RC7_2 RC8_1 RC8_2 RC9_1 RC9_2 RC10_1 RC10_2 RC11_1 RC11_2 RC12_1 RC12_2 RL1_1 RL1_2 RL2_1 RL2_2 RL3_1 RL3_2 RL4_1 RL4_2 RL5_1 RL5_2 RL6_1 RL6_2 RL7_1 RL7_2 RL8_1 RL8_2 RL9_1 RL9_2 RL10_1 RL10_2 RL11_1 RL11_2 RL12_1 RL12_2 RS1_1 RS1_2 RS2_1 RS2_2 RS3_1 RS3_2 RS4_1 RS4_2 RS5_1 RS5_2 RS6_1 RS6_2 RS7_1 RS7_2 RS8_1 RS8_2 RS9_1 RS9_2 RS10_1 RS10_2 RS11_1 RS11_2 RS12_1 RS12_2 = resistor:R-US_: RESISTOR, American symbol
RB1_1 RB1_2 RB2_1 RB2_2 RB3_1 RB3_2 RB4_1 RB4_2 RB5_1 RB5_2 RB6_1 RB6_2 RB7_1 RB7_2 RB8_1 RB8_2 RB9_1 RB9_2 RB10_1 RB10_2 RB11_1 RB11_2 RB12_1 RB12_2 = Library_Capstone:2817_RESISTOR
T1_3-T1_14 T1_25-T1_36 = Library_Capstone:BSS308PEH6327
U1 U3 = LTC6811HG-2_PBF:LTC6811HG-2#PBF: LTC6811-1/LTC6811-2 - Multicell Battery Monitors; AVAILABILITY: Unavailable; DESCRIPTION: LTC6811-1/LTC6811-2 - Multicell Battery Monitors; MF: Linear Technology/Analog; MP: LTC6811HG-2#PBF; PACKAGE: SSOP-48 Linear Technology; PRICE: None
U$1 U$3 = HM2112ZNL:HM2112ZNL_PULSE_ELECTRONICS_TRANSFORMER